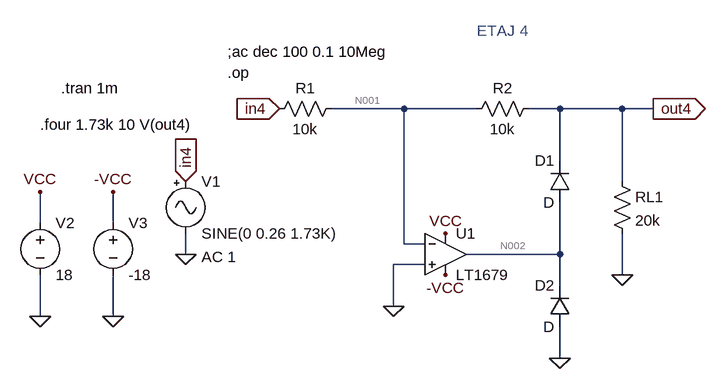
[diagram p0: schematic Etaj4.asc]
* Etaj4.asc
RL1 out4 0 20k
R1 N001 in4 10k
R2 out4 N001 10k
D1 N002 out4 D
D2 0 N002 D
* U1: LT1679 (symbol OpAmps\LT1679 not available, pins judged from their places): In+=0 In-=N001 V+=VCC V-=-VCC OUT=N002
V1 in4 0 SINE(0 0.26 1.73K) AC 1
V2 VCC 0 18
V3 -VCC 0 -18
.model D D
.lib standard.dio
* ETAJ 4
;ac dec 100 0.1 10Meg
.tran 1m
.four 1.73k 10 V(out4)
.op
.backanno
.end

* Results of the author's LTspice run, read from the files saved beside the schematic
* Operating Point, zero values left out:
*   V(out4) = 6.227 µV
*   V(n001) = 2.372 µV
*   V(n002) = 288.4 mV
*   V(vcc) = 18 V
*   V(-vcc) = -18 V
*   I(D1) = 696.7 pA
*   I(R2) = 385.4 pA
*   I(R1) = 237.2 pA
*   I(Rl1) = 311.3 pA
*   I(V3) = 2.522 mA
*   I(V2) = -2.522 mA
*   I(V1) = 237.2 pA
*   Ix(u1:1) = 148.2 pA
*   Ix(u1:2) = 148.2 pA
*   Ix(u1:3) = -697.6 pA
*   Ix(u1:4) = 2.522 mA
*   Ix(u1:5) = -2.522 mA
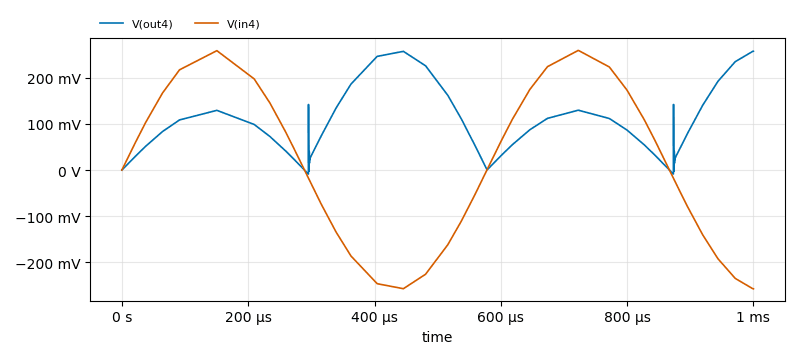
[diagram p1: Transient Analysis of Etaj4.asc, plotted from the saved traces]
* Transient Analysis, 1 run:
*   V(out4): min -8.721 mV, max 257.9 mV, average 114.8 mV, rms 135.8 mV, last 257.9 mV
*   V(in4): min -257.9 mV, max 259.9 mV, average 25.79 mV, rms 180.6 mV, last -257.9 mV
* From the log:
*   N-Period=1
*   Fourier components of V(out4)
*   DC component:0.124041
*   Harmonic  Frequency   Fourier   Normalized   Phase    Normalized
*    Number     [Hz]     Component   Component  [degree]  Phase [deg]
*       1     1.730e+03  6.496e-02  1.000e+00    179.82°      0.00°
*       2     3.460e+03  8.286e-02  1.276e+00    -90.04°   -269.86°
*       3     5.190e+03  2.001e-04  3.081e-03    105.55°    -74.26°
*       4     6.920e+03  1.679e-02  2.585e-01    -90.15°   -269.96°
*       5     8.650e+03  1.832e-04  2.820e-03     65.18°   -114.64°
*       6     1.038e+04  7.262e-03  1.118e-01    -89.92°   -269.74°
*       7     1.211e+04  2.488e-04  3.831e-03     88.10°    -91.72°
*       8     1.384e+04  4.147e-03  6.383e-02    -90.93°   -270.75°
*       9     1.557e+04  2.379e-04  3.662e-03     99.83°    -79.99°
*      10     1.730e+04  2.724e-03  4.193e-02    -92.51°   -272.33°
*   Total Harmonic Distortion: 130.854552%(131.058112%)